# EAGLE design TSL1401CL-Adapter (EAGLE 6.4)
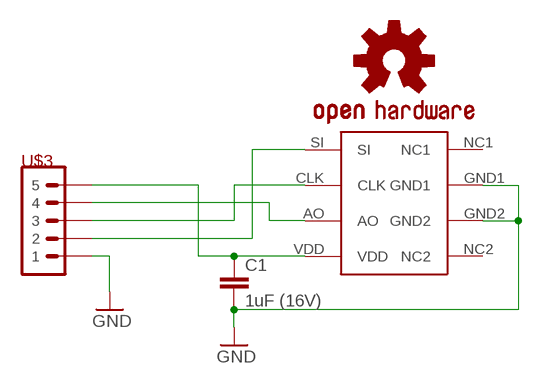
[diagram p0: schematic, sheet 1]

## Parts
C1  1uF (16V)  CAP0603-CAP  [0603-CAP]
U$1  TSL1401CL  [TSL1401CL]
U$2  OSHW-LOGOM  [OSHW-LOGO-M]
U$3  M05  [M05JST-PTH]

## Nets
+5V: C1.1 U$1.VDD U$3.P$5
AO: U$1.AO U$3.P$4
CLK: U$1.CLK U$3.P$3
GND: C1.2 U$1.GND1 U$1.GND2 U$3.P$1
SI: U$1.SI U$3.P$2
Unconnected: U$1.NC1 U$1.NC2

## Library data of the parts
C1 = SparkFun-Passives:CAP: Capacitor Standard 0603 ceramic capacitor, and 0.1" leaded capacitor.
U$1 = BIG:TSL1401: 128 x 1 Linear Sensor Array with Hold The TSL1401 linear sensor array consists of a 128 × 1 array of photodiodes, associated charge amplifier circuitry, and an internal pixel data-hold function that provides simultaneous-integration start and stop times for all pixels. The array is made up of 128 pixels, each of which has a photo-sensitive area of 3,524.3 square micrometers. There is 8-?m spacing between pixels. Operation is simplified by internal control logic that requires only a serial-input (SI) signal and a clock.
U$2 = SparkFun:OSHW-LOGO: Open Source Hardware Logo This logo indicates the piece of hardware it is found on incorporates a OSHW license and/or adheres to the definition of open source hardware found here: http://freedomdefined.org/OSHW
U$3 = BIG:M05

## Board
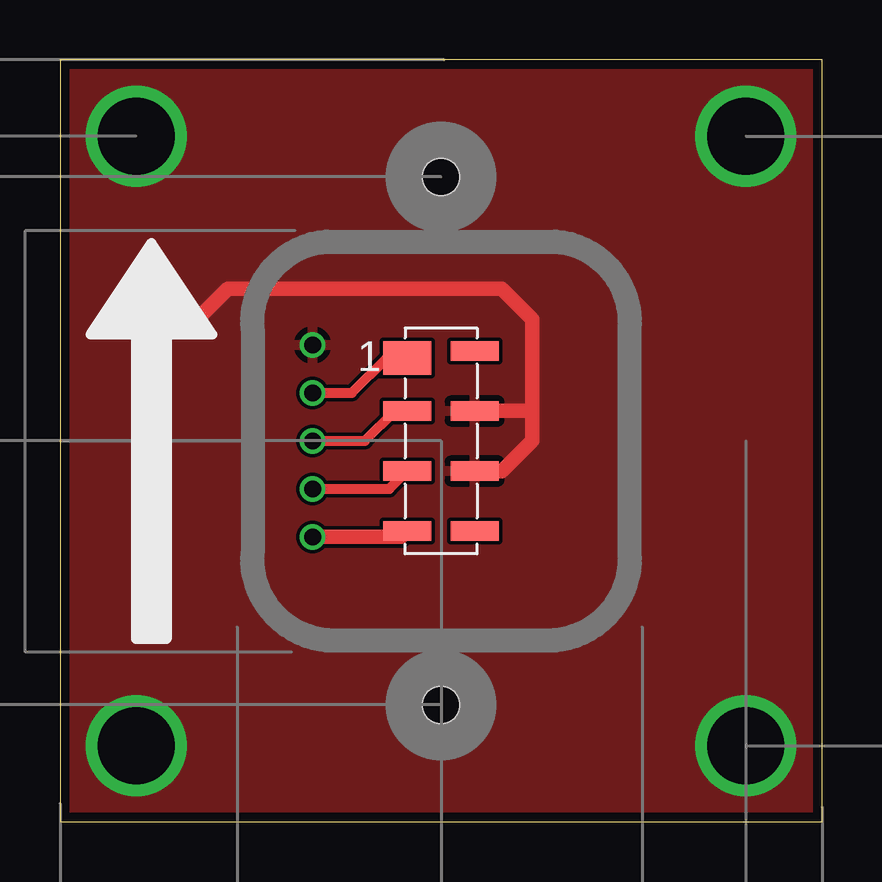
[diagram p1: board, top side]
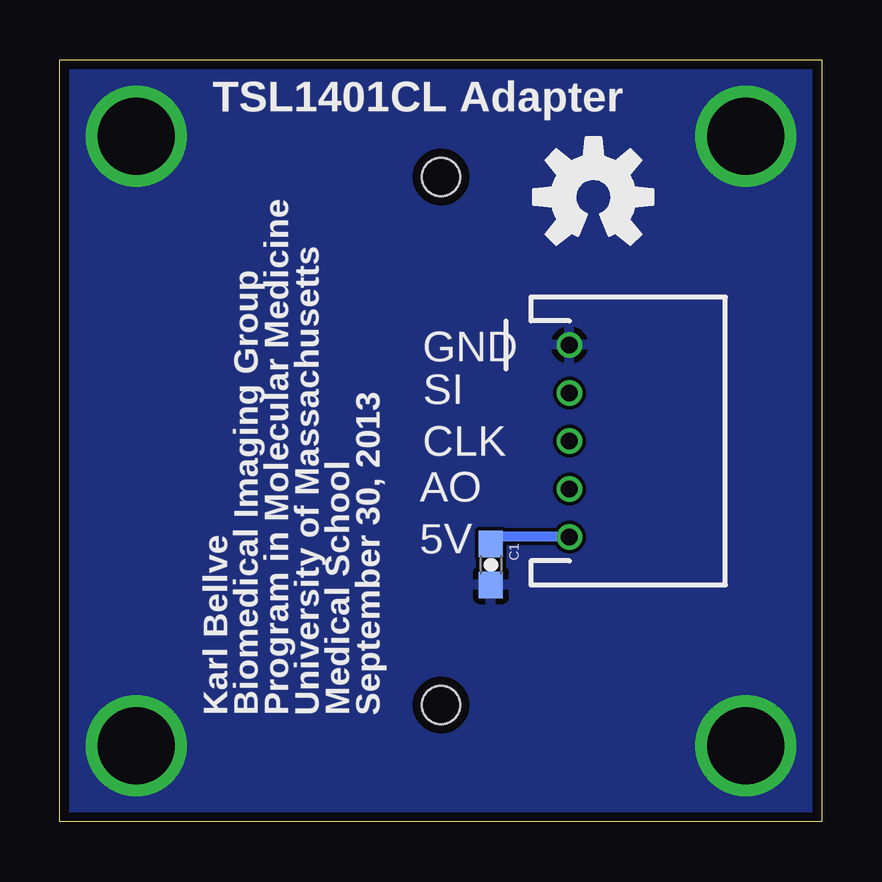
[diagram p2: board, bottom side, seen from below]

Size 31.75 x 31.75 mm. Coordinates in mm from the lower left corner, seen from the top.
Outline: 0,0 31.75,0 31.75,31.75 0,31.75 0,0
Copper layers (1*16): Top 0.0356mm / dielectric 1.5011mm / Bottom 0.0356mm
Design rules "LaenPCBOrder": minimum track width 6mil, minimum drill 13mil, track to track 6mil, track to pad 6mil, pad to pad 6mil, via to via 6mil, smd to smd 6mil, copper to edge 15mil, drill to drill 6mil, minimum pad ring 7mil, minimum via ring 7mil, stop-mask expansion 4mil, vias tented up to drill 0mil, thermal gap 10mil

### Footprints (pad centres in the part's own frame; a part is rotated, then mirrored left to right if it is on the bottom)
0603-CAP = smd 1.1 x 1: 1 -0.85,0; 2 0.85,0
TSL1401CL = smd 2 x 0.8: AO -1.4,-1.25; CLK -1.4,1.25; GND1 1.4,1.25; GND2 1.4,-1.25; NC1 1.4,3.75; NC2 1.4,-3.75; VDD -1.4,-3.75 | smd 2 x 1.4: SI -1.4,3.45 | hole 1.6: 0,11; 0,-11
M05JST-PTH = drill 0.7: P$1 0,-4; P$2 0,-2; P$3 0,0; P$4 0,2; P$5 0,4

### Placement (x,y rotation side)
C1  13.8,10.72 270 bottom
U$1  15.88,15.88 0 top
U$2  9.53,26.04 0 bottom
U$3  10.53,15.88 180 bottom

### Tracks (layer width: path | path; a pad name or v marks a point on that pad's centre or on a via)
+5V
  Top 0.61: U$3.P$5 14.22,11.88 U$1.VDD
  Bottom 0.406: U$3.P$5 13.36,11.88 C1.1
AO
  Top 0.406: U$3.P$4 13.72,13.88 U$1.AO
CLK
  Top 0.406: U$3.P$3 12.7,15.88 13.97,17.15 14.46,17.15 U$1.CLK
GND  (via drill 3.2)
  Top 0.406: 17.3,17.15 U$1.GND1 | 17.3,14.64 U$1.GND2
  Top 0.61: 5.71,20.96 6.98,22.23 18.42,22.23 19.69,20.96 19.69,17.15 | 19.69,17.15 19.69,15.88 18.42,14.61 17.3,14.61 U$1.GND2 | U$1.GND1 19.67,17.12 19.69,17.15
  other vias: 3.17,28.58 3.17,3.17 28.58,28.58 28.58,3.17
  pour Top: 0,31.75 0,0 31.75,0 31.75,31.75
  pour Bottom: 0,31.75 0,0 31.75,0 31.75,31.75
SI
  Top 0.406: U$3.P$2 12.16,17.88 13.61,19.33 U$1.SI

### Text on the board
bPlace: TSL1401CL Adapter | GND | SI | CLK | AO | 5V | September 30, 2013 | Medical School | University of Massachusetts | Program in Molecular Medicine | Biomedical Imaging Group | Karl Bellve
tDocu: Four Board Holes are 3.175mm (1/8") in diameter